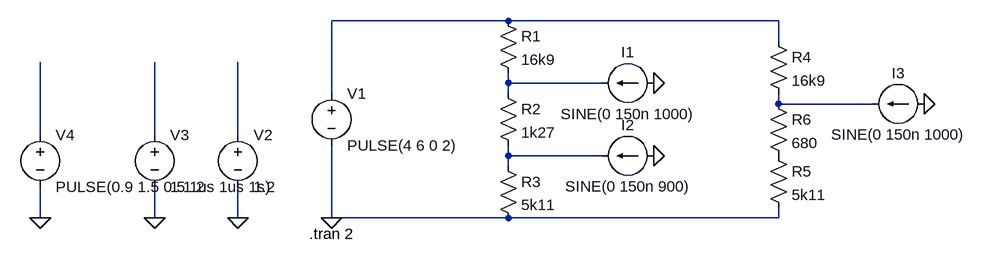
[diagram p0: schematic TPS26631.asc]
TPS26631.asc, the LTspice schematic file:
Version 4
SHEET 1 928 680
WIRE 208 0 -64 0
WIRE 624 0 208 0
WIRE 624 32 624 0
WIRE 208 96 208 80
WIRE 352 96 208 96
WIRE -64 112 -64 0
WIRE 208 112 208 96
WIRE 624 128 624 112
WIRE 768 128 624 128
WIRE -512 176 -512 64
WIRE -336 176 -336 64
WIRE -208 176 -208 64
WIRE 208 208 208 192
WIRE 352 208 208 208
WIRE 208 224 208 208
WIRE -512 304 -512 256
WIRE -336 304 -336 256
WIRE -208 304 -208 256
WIRE -64 304 -64 192
WIRE 208 304 -64 304
WIRE 624 304 624 288
WIRE 624 304 208 304
FLAG -64 304 0
FLAG 432 208 0
FLAG 432 96 0
FLAG -208 304 0
FLAG -336 304 0
FLAG 848 128 0
FLAG -512 304 0
SYMBOL res 192 -16 R0
SYMATTR InstName R1
SYMATTR Value 16k9
SYMBOL res 192 96 R0
SYMATTR InstName R2
SYMATTR Value 1k27
SYMBOL res 192 208 R0
SYMATTR InstName R3
SYMATTR Value 5k11
SYMBOL voltage -64 96 R0
WINDOW 123 0 0 Left 2
WINDOW 39 0 0 Left 2
SYMATTR InstName V1
SYMATTR Value PULSE(4 6 0 2)
SYMBOL current 432 96 R90
WINDOW 0 -32 40 VBottom 2
WINDOW 3 32 40 VTop 2
WINDOW 123 0 0 Left 2
WINDOW 39 0 0 Left 2
SYMATTR InstName I1
SYMATTR Value SINE(0 150n 1000)
SYMBOL current 432 208 R90
WINDOW 0 -32 40 VBottom 2
WINDOW 3 32 40 VTop 2
WINDOW 123 0 0 Left 2
WINDOW 39 0 0 Left 2
SYMATTR InstName I2
SYMATTR Value SINE(0 150n 900)
SYMBOL voltage -208 160 R0
WINDOW 123 0 0 Left 2
WINDOW 39 0 0 Left 2
SYMATTR InstName V2
SYMATTR Value 1.2
SYMBOL voltage -336 160 R0
WINDOW 123 0 0 Left 2
WINDOW 39 0 0 Left 2
SYMATTR InstName V3
SYMATTR Value 1.1.2
SYMBOL res 608 16 R0
SYMATTR InstName R4
SYMATTR Value 16k9
SYMBOL res 608 192 R0
SYMATTR InstName R5
SYMATTR Value 5k11
SYMBOL current 848 128 R90
WINDOW 0 -32 40 VBottom 2
WINDOW 3 32 40 VTop 2
WINDOW 123 0 0 Left 2
WINDOW 39 0 0 Left 2
SYMATTR InstName I3
SYMATTR Value SINE(0 150n 1000)
SYMBOL res 608 112 R0
SYMATTR InstName R6
SYMATTR Value 680
SYMBOL voltage -512 160 R0
WINDOW 123 0 0 Left 2
WINDOW 39 0 0 Left 2
SYMATTR InstName V4
SYMATTR Value PULSE(0.9 1.5 0.5 1us 1us 1s)
TEXT -98 328 Left 2 !.tran 2

The netlist it stands for:
* TPS26631.asc
R1 N001 N002 16k9
R2 N002 N007 1k27
R3 N007 0 5k11
V1 N001 0 PULSE(4 6 0 2)
I1 0 N002 SINE(0 150n 1000)
I2 0 N007 SINE(0 150n 900)
V2 N006 0 1.2
V3 N005 0 1.1.2
R4 N001 N003 16k9
R5 P001 0 5k11
I3 0 N003 SINE(0 150n 1000)
R6 N003 P001 680
V4 N004 0 PULSE(0.9 1.5 0.5 1us 1us 1s)
.tran 2
.backanno
.end